# EAGLE board openadc_ztex (EAGLE 6.4), part 1 of 2
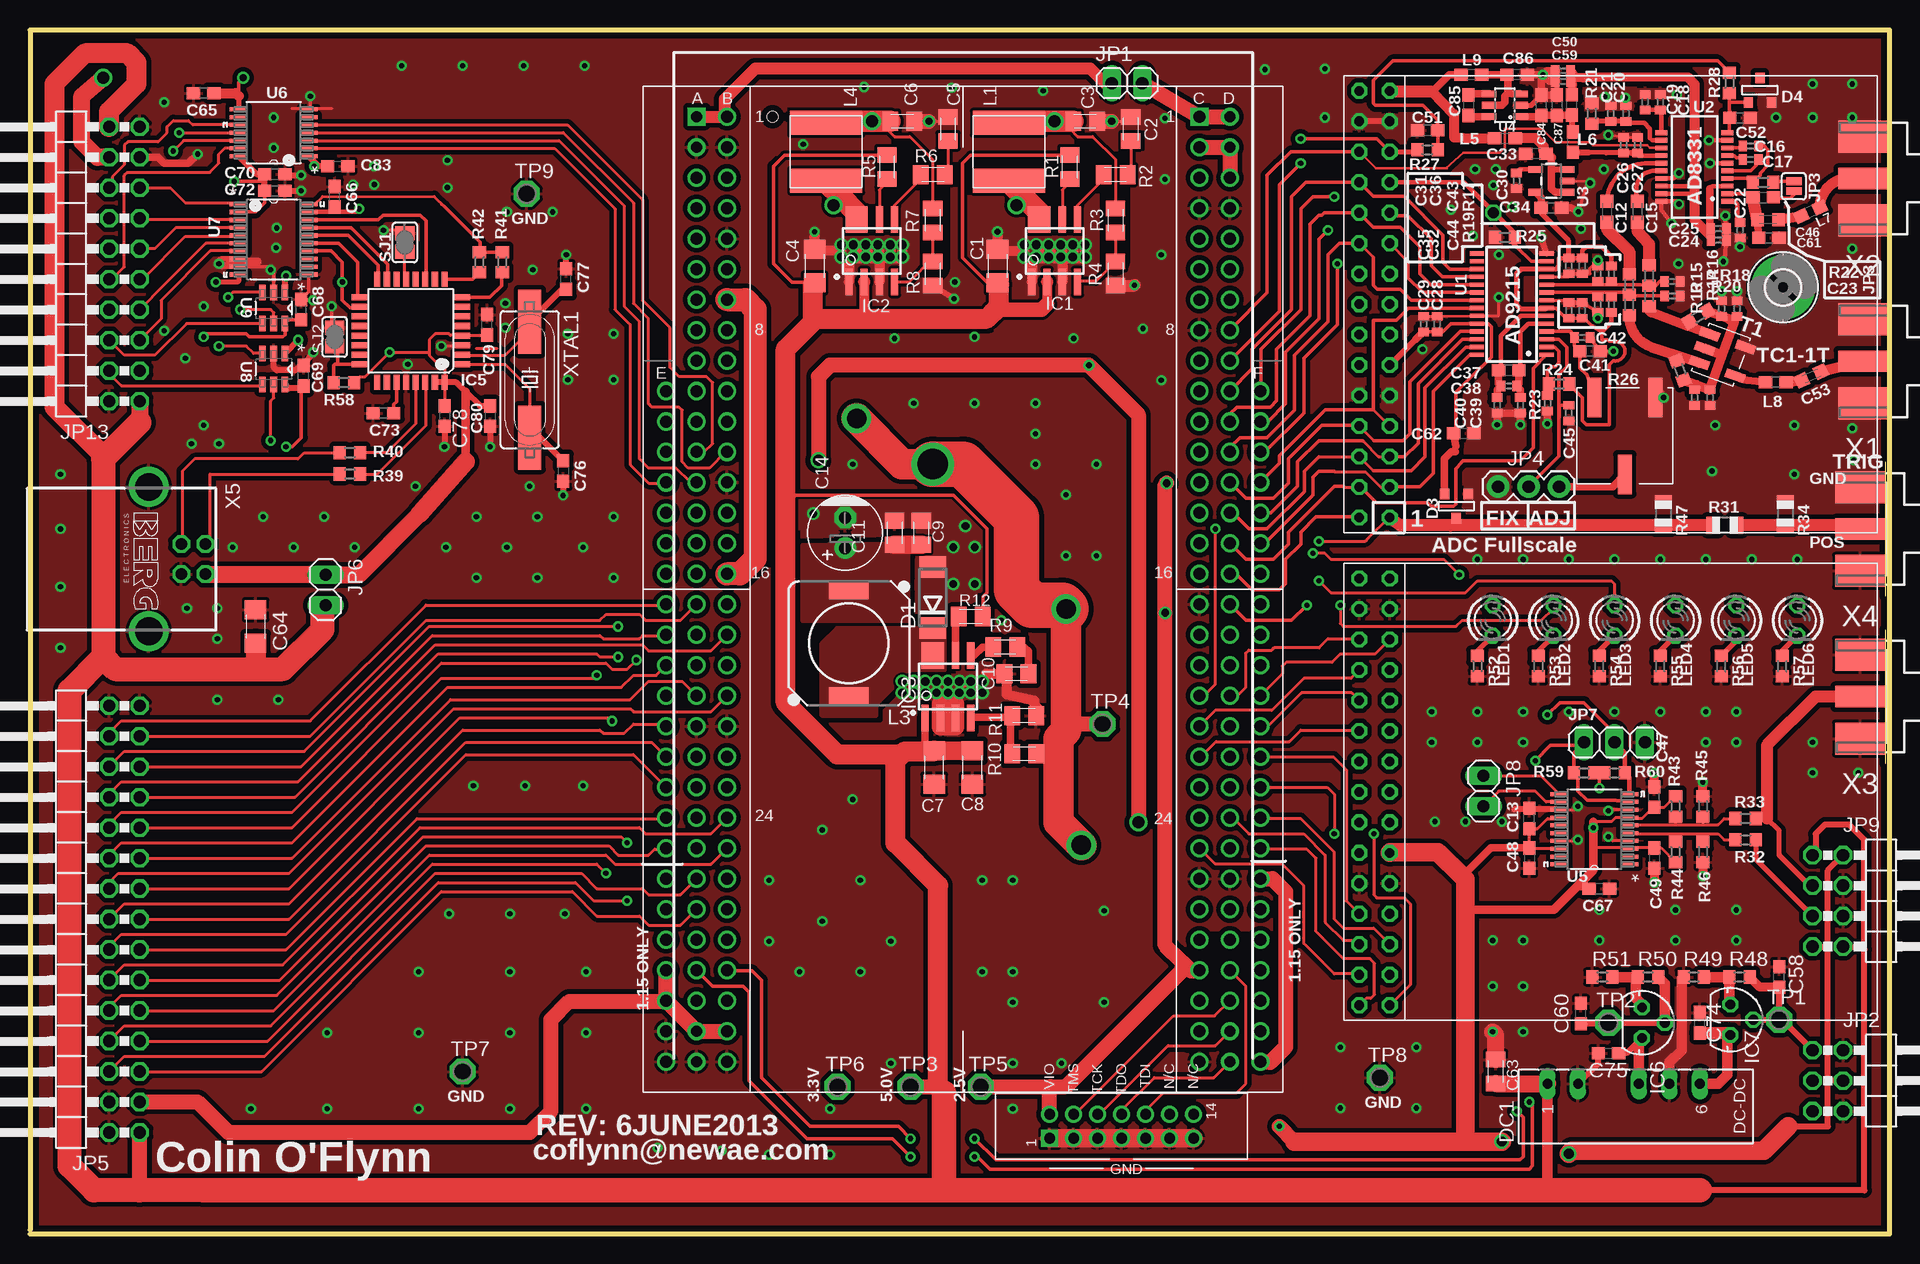
[diagram p8: board, top side]
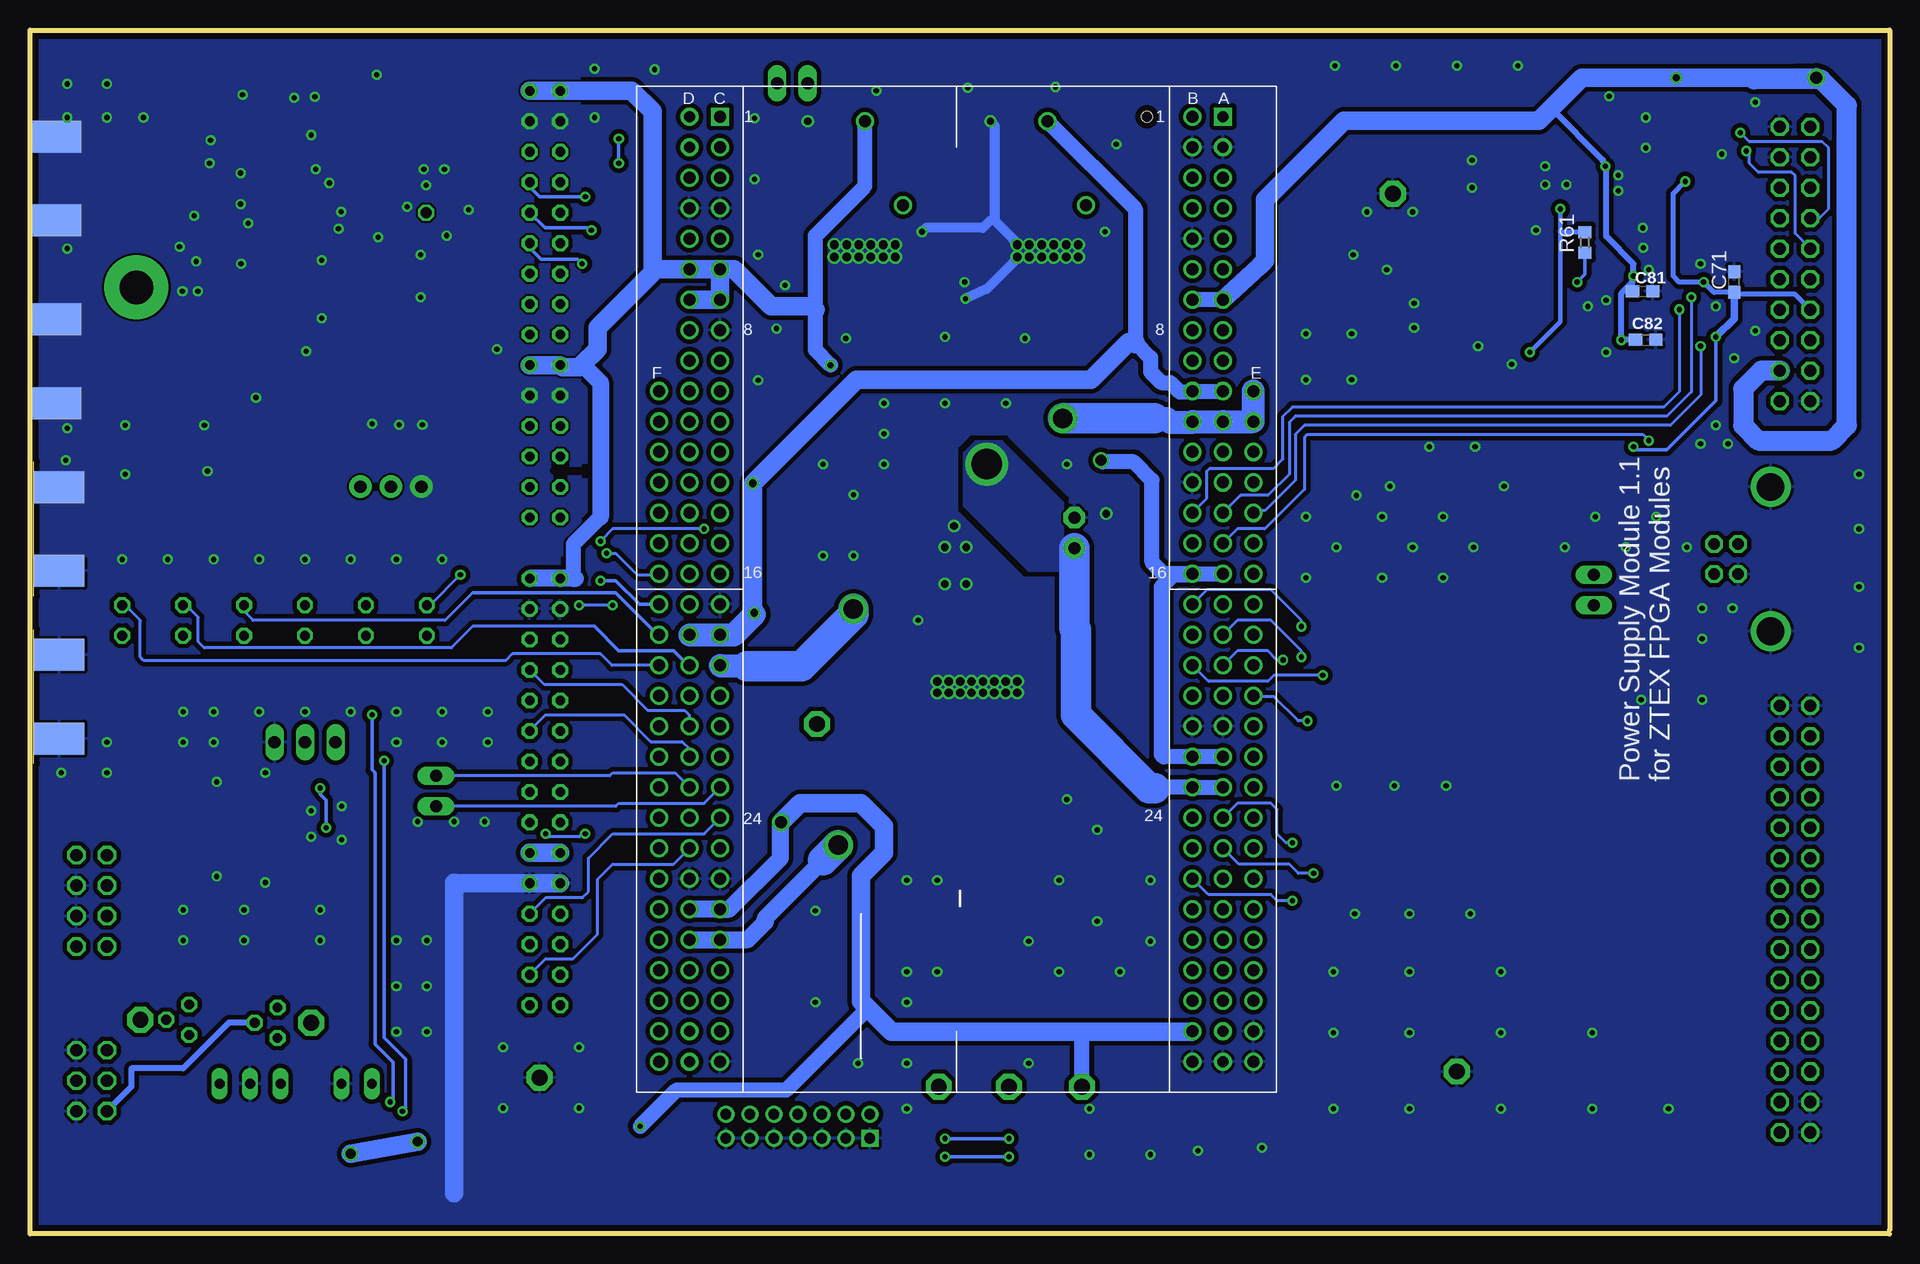
[diagram p9: board, bottom side, seen from below]

Size 155 x 100.32 mm. Coordinates in mm from the lower left corner, seen from the top.
Outline: 0,0 155,0 155,100.32 0,100.32 0,0.32
Copper layers (1*16): Top 0.035mm / dielectric 1.5mm / Bottom 0.035mm
Design rules "default *": minimum track width 7mil, minimum drill 17mil, track to track 7mil, track to pad 7mil, pad to pad 7mil, via to via 7mil, smd to smd 2mil, copper to edge 20mil, drill to drill 12mil, minimum pad ring 10mil, minimum via ring 8mil, stop-mask expansion 4mil, vias tented up to drill 170mil, thermal gap 10mil
tRestrict: 12 lines
bRestrict: 1 lines

## Footprints (pad centres in the part's own frame; a part is rotated, then mirrored left to right if it is on the bottom)
C1206 = smd 1.6 x 1.8: 1 -1.4,0; 2 1.4,0
C0805K = smd 1.3 x 1.6: 1 -1,0; 2 1,0
C0603K = smd 1.05 x 1.08: 1 -0.875,0; 2 0.875,0
C0603 = smd 1.1 x 1: 1 -0.85,0; 2 0.85,0
E2,5-6 = drill 1 pad 1.8: + -1.27,0 | drill 1 pad 1.8 octagon: - 1.27,0
C0402 = smd 0.7 x 0.9: 1 -0.65,0; 2 0.65,0
JTAG = drill 0.9 square: 1 1,-6 | drill 0.9: 2 -1,-6; 3 1,-4; 4 -1,-4; 5 1,-2; 6 -1,-2; 7 1,0; 8 -1,0; 9 1,2; 10 -1,2; 11 1,4; 12 -1,4; 13 1,6; 14 -1,6
USB-FPGA1.15 = drill 0.925 pad 1.5 square: A1 2.54,1.905 | drill 0.925 pad 1.5: A2 5.08,1.905; A31 78.74,1.905; A32 81.28,1.905; D1 2.54,46.355; D2 5.08,46.355; D31 78.74,46.355; D32 81.28,46.355 | drill 1 pad 1.5: A3 7.62,1.905; A4 10.16,1.905; A5 12.7,1.905; A6 15.24,1.905; A7 17.78,1.905; A8 20.32,1.905; A9 22.86,1.905; A10 25.4,1.905; A11 27.94,1.905; A12 30.48,1.905; A13 33.02,1.905; A14 35.56,1.905; A15 38.1,1.905; A16 40.64,1.905; A17 43.18,1.905; A18 45.72,1.905; A19 48.26,1.905; A20 50.8,1.905; A21 53.34,1.905; A22 55.88,1.905; A23 58.42,1.905; A24 60.96,1.905; A25 63.5,1.905; A26 66.04,1.905; A27 68.58,1.905; A28 71.12,1.905; A29 73.66,1.905; A30 76.2,1.905; B1 2.54,4.445; B2 5.08,4.445; B3 7.62,4.445; B4 10.16,4.445; B5 12.7,4.445; B6 15.24,4.445; B7 17.78,4.445; B8 20.32,4.445; B9 22.86,4.445; B10 25.4,4.445; B11 27.94,4.445; B12 30.48,4.445; B13 33.02,4.445; B14 35.56,4.445; B15 38.1,4.445; B16 40.64,4.445; B17 43.18,4.445; B18 45.72,4.445; B19 48.26,4.445; B20 50.8,4.445; B21 53.34,4.445; B22 55.88,4.445; B23 58.42,4.445; B24 60.96,4.445; B25 63.5,4.445; B26 66.04,4.445; B27 68.58,4.445; B28 71.12,4.445; B29 73.66,4.445; B30 76.2,4.445; B31 78.74,4.445; B32 81.28,4.445; C2 5.08,43.815; C3 7.62,43.815; C4 10.16,43.815; C5 12.7,43.815; C6 15.24,43.815; C7 17.78,43.815; C8 20.32,43.815; C9 22.86,43.815; C10 25.4,43.815; C11 27.94,43.815; C12 30.48,43.815; C13 33.02,43.815; C14 35.56,43.815; C15 38.1,43.815; C16 40.64,43.815; C17 43.18,43.815; C18 45.72,43.815; C19 48.26,43.815; C20 50.8,43.815; C21 53.34,43.815; C22 55.88,43.815; C23 58.42,43.815; C24 60.96,43.815; C25 63.5,43.815; C26 66.04,43.815; C27 68.58,43.815; C28 71.12,43.815; C29 73.66,43.815; C30 76.2,43.815; C31 78.74,43.815; C32 81.28,43.815; D3 7.62,46.355; D4 10.16,46.355; D5 12.7,46.355; D6 15.24,46.355; D7 17.78,46.355; D8 20.32,46.355; D9 22.86,46.355; D10 25.4,46.355; D11 27.94,46.355; D12 30.48,46.355; D13 33.02,46.355; D14 35.56,46.355; D15 38.1,46.355; D16 40.64,46.355; D17 43.18,46.355; D18 45.72,46.355; D19 48.26,46.355; D20 50.8,46.355; D21 53.34,46.355; D22 55.88,46.355; D23 58.42,46.355; D24 60.96,46.355; D25 63.5,46.355; D26 66.04,46.355; D27 68.58,46.355; D28 71.12,46.355; D29 73.66,46.355; D30 76.2,46.355; E10 25.4,-0.635; E11 27.94,-0.635; E12 30.48,-0.635; E13 33.02,-0.635; E14 35.56,-0.635; E15 38.1,-0.635; E16 40.64,-0.635; E17 43.18,-0.635; E18 45.72,-0.635; E19 48.26,-0.635; E20 50.8,-0.635; E21 53.34,-0.635; E22 55.88,-0.635; E23 58.42,-0.635; E24 60.96,-0.635; E25 63.5,-0.635; E26 66.04,-0.635; E27 68.58,-0.635; E28 71.12,-0.635; E29 73.66,-0.635; E30 76.2,-0.635; E31 78.74,-0.635; E32 81.28,-0.635; F10 25.4,48.895; F11 27.94,48.895; F12 30.48,48.895; F13 33.02,48.895; F14 35.56,48.895; F15 38.1,48.895; F16 40.64,48.895; F17 43.18,48.895; F18 45.72,48.895; F19 48.26,48.895; F20 50.8,48.895; F21 53.34,48.895; F22 55.88,48.895; F23 58.42,48.895; F24 60.96,48.895; F25 63.5,48.895; F26 66.04,48.895; F27 68.58,48.895; F28 71.12,48.895; F29 73.66,48.895; F30 76.2,48.895; F31 78.74,48.895; F32 81.28,48.895 | drill 1 pad 1.5 square: C1 2.54,43.815 | hole 0.9: 2.54,8.255
DO214AA = smd 1.8 x 2.2: A 2.55,0; C -2.55,0
SOT-23 = smd 0.787 x 0.889: 1 0.025,-1.016; 2 -0.94,1.016; 3 0.991,1.016
NMA = drill 0.813 long: 1 0,6.35; 2 0,3.81; 4 0,-1.27; 5 0,-3.81; 6 0,-6.35
2,8-PAD = drill 2.8 pad 5.334: B2,8 0,0
AOZ1021 = smd 0.6 x 2.2: AGND 0.635,-2.6; COMP 1.905,2.6; EN 0.635,2.6; FB 1.905,-2.6; PGND -1.905,-2.6; VIN -0.635,-2.6 | smd 1.87 x 2.2: LX -1.27,2.6
AOZ1094.PAC = smd 0.6 x 2.2: AGND 0.635,-2.6; COMP 1.905,2.6; EN 0.635,2.6; FB 1.905,-2.6; PGND -0.635,-2.6; VIN -1.905,-2.6 | smd 1.87 x 2.2: LX -1.27,2.6
TQFP32-08 = smd 1.27 x 0.508: 1 -4.293,2.8; 2 -4.293,2; 3 -4.293,1.2; 4 -4.293,0.4; 5 -4.293,-0.4; 6 -4.293,-1.2; 7 -4.293,-2; 8 -4.293,-2.8; 17 4.293,-2.8; 18 4.293,-2; 19 4.293,-1.2; 20 4.293,-0.4; 21 4.293,0.4; 22 4.293,1.2; 23 4.293,2; 24 4.293,2.8 | smd 0.508 x 1.27: 9 -2.8,-4.293; 10 -2,-4.293; 11 -1.2,-4.293; 12 -0.4,-4.293; 13 0.4,-4.293; 14 1.2,-4.293; 15 2,-4.293; 16 2.8,-4.293; 25 2.8,4.293; 26 2,4.293; 27 1.2,4.293; 28 0.4,4.293; 29 -0.4,4.293; 30 -1.2,4.293; 31 -2,4.293; 32 -2.8,4.293
337L = drill 0.813 octagon: ADJ -1.27,0; IN 1.27,0; OUT 0,1.905
317L = drill 0.813 octagon: 1 -1.27,0; 2 0,1.905; 3 1.27,0
1X02 = drill 1.016 long: 1 -1.27,0; 2 1.27,0
2X03/90 = drill 1.016 octagon: 1 -2.54,-6.35; 2 -2.54,-3.81; 3 0,-6.35; 4 0,-3.81; 5 2.54,-6.35; 6 2.54,-3.81
SJ_2S = smd 0.635 x 1.27: 1 -0.412,0; 2 0.412,0
1X03 = drill 1.016 pad 1.88: 1 0,0; 2 2.54,0; 3 5.08,0
2X15/90 = drill 1.016 octagon: 1 -17.78,-6.35; 2 -17.78,-3.81; 3 -15.24,-6.35; 4 -15.24,-3.81; 5 -12.7,-6.35; 6 -12.7,-3.81; 7 -10.16,-6.35; 8 -10.16,-3.81; 9 -7.62,-6.35; 10 -7.62,-3.81; 11 -5.08,-6.35; 12 -5.08,-3.81; 13 -2.54,-6.35; 14 -2.54,-3.81; 15 0,-6.35; 16 0,-3.81; 17 2.54,-6.35; 18 2.54,-3.81; 19 5.08,-6.35; 20 5.08,-3.81; 21 7.62,-6.35; 22 7.62,-3.81; 23 10.16,-6.35; 24 10.16,-3.81; 25 12.7,-6.35; 26 12.7,-3.81; 27 15.24,-6.35; 28 15.24,-3.81; 29 17.78,-6.35; 30 17.78,-3.81
1X03' = drill 1.016 long: 1 -2.54,0; 2 0,0; 3 2.54,0
2X04/90 = drill 1.016 octagon: 1 -3.81,-6.35; 2 -3.81,-3.81; 3 -1.27,-6.35; 4 -1.27,-3.81; 5 1.27,-6.35; 6 1.27,-3.81; 7 3.81,-6.35; 8 3.81,-3.81
2X10/90 = drill 1.016 octagon: 1 -11.43,-6.35; 2 -11.43,-3.81; 3 -8.89,-6.35; 4 -8.89,-3.81; 5 -6.35,-6.35; 6 -6.35,-3.81; 7 -3.81,-6.35; 8 -3.81,-3.81; 9 -1.27,-6.35; 10 -1.27,-3.81; 11 1.27,-6.35; 12 1.27,-3.81; 13 3.81,-6.35; 14 3.81,-3.81; 15 6.35,-6.35; 16 6.35,-3.81; 17 8.89,-6.35; 18 8.89,-3.81; 19 11.43,-6.35; 20 11.43,-3.81
NR60 = smd 2 x 6: P$1 -2.4,0; P$2 2.4,0
0603 = smd 1.1 x 1: 1 -0.85,0; 2 0.85,0
DR1030 = smd 3.3 x 1.6: 1 0,4.45; 2 0,-4.45
LED-3MM = drill 0.813 octagon: A -1.27,0; K 1.27,0
R0805K = smd 1.3 x 1.6: 1 -1,0; 2 1,0
R0603 = smd 1 x 1.1: 1 -0.85,0; 2 0.85,0
R0402 = smd 0.7 x 0.9: 1 -0.65,0; 2 0.65,0
3361P = smd 1.19 x 3.3: 1 -2.54,0; 2 0,6.4; 3 2.54,0
R0805 = smd 1.1 x 1.4: 1 -1,0; 2 1,0
SJ = smd 1.168 x 1.6: 1 -0.762,0; 2 0.762,0
AT224-1A = smd 0.762 x 1.651: 1 -1.27,2.54; 2 0,2.54; 3 1.27,2.54; 4 1.27,-0.635; 6 -1.27,-0.635
P1-13 = drill 1.321 pad 2.159 octagon: TP 0,0
TSSOP28 = smd 0.35 x 1.2: 1 -4.225,-2.9; 2 -3.575,-2.9; 3 -2.925,-2.9; 4 -2.275,-2.9; 5 -1.625,-2.9; 6 -0.975,-2.9; 7 -0.325,-2.9; 8 0.325,-2.9; 9 0.975,-2.9; 10 1.625,-2.9; 11 2.275,-2.9; 12 2.925,-2.9; 13 3.575,-2.9; 14 4.225,-2.9; 15 4.225,2.9; 16 3.575,2.9; 17 2.925,2.9; 18 2.275,2.9; 19 1.625,2.9; 20 0.975,2.9; 21 0.325,2.9; 22 -0.325,2.9; 23 -0.975,2.9; 24 -1.625,2.9; 25 -2.275,2.9; 26 -2.925,2.9; 27 -3.575,2.9; 28 -4.225,2.9
QSOP20 = smd 0.4 x 1: 1 -2.858,-2.75; 2 -2.223,-2.75; 3 -1.588,-2.75; 4 -0.953,-2.75; 5 -0.318,-2.75; 6 0.318,-2.75; 7 0.953,-2.75; 8 1.588,-2.75; 9 2.223,-2.75; 10 2.858,-2.75; 11 2.858,2.75; 12 2.223,2.75; 13 1.588,2.75; 14 0.953,2.75; 15 0.318,2.75; 16 -0.318,2.75; 17 -0.953,2.75; 18 -1.588,2.75; 19 -2.223,2.75; 20 -2.858,2.75
SOT23-5 = smd 0.55 x 1.2: 1 -0.95,-1.3; 2 0,-1.3; 3 0.95,-1.3; 4 0.95,1.3; 5 -0.95,1.3
SOT23-6L = smd 0.55 x 1.2: 1 -0.95,-1.3; 2 0,-1.3; 3 0.95,-1.3; 4 0.95,1.3; 5 0,1.3; 6 -0.95,1.3
SOP65P640X120-20N = smd 1.473 x 0.356: 1 -2.921,2.921; 2 -2.921,2.286; 3 -2.921,1.626; 4 -2.921,0.965; 5 -2.921,0.33; 6 -2.921,-0.33; 7 -2.921,-0.965; 8 -2.921,-1.626; 9 -2.921,-2.286; 10 -2.921,-2.921; 11 2.921,-2.921; 12 2.921,-2.286; 13 2.921,-1.626; 14 2.921,-0.965; 15 2.921,-0.33; 16 2.921,0.33; 17 2.921,0.965; 18 2.921,1.626; 19 2.921,2.286; 20 2.921,2.921
SOP65P640X120-14N = smd 1.473 x 0.356: 1 -2.921,1.956; 2 -2.921,1.295; 3 -2.921,0.66; 4 -2.921,0; 5 -2.921,-0.66; 6 -2.921,-1.295; 7 -2.921,-1.956; 8 2.921,-1.956; 9 2.921,-1.295; 10 2.921,-0.66; 11 2.921,0; 12 2.921,0.66; 13 2.921,1.295; 14 2.921,1.956
SOT95P280X145-6N = smd 1.27 x 0.559: 1 -1.295,0.94; 2 -1.295,0; 3 -1.295,-0.94; 4 1.295,-0.94; 5 1.295,0; 6 1.295,0.94
OPENADCREV1 = drill 0.8 octagon: 1 0,17.78; 2 2.54,17.78; 3 0,15.24; 4 2.54,15.24; 5 0,12.7; 6 2.54,12.7; 7 0,10.16; 8 2.54,10.16; 9 0,7.62; 10 2.54,7.62; 11 0,5.08; 12 2.54,5.08; 13 0,2.54; 14 2.54,2.54; 15 0,0; 16 2.54,0; 17 0,-2.54; 18 2.54,-2.54; 19 0,-5.08; 20 2.54,-5.08; 21 0,-7.62; 22 2.54,-7.62; 23 0,-10.16; 24 2.54,-10.16; 25 0,-12.7; 26 2.54,-12.7; 27 0,-15.24; 28 2.54,-15.24; 29 0,-17.78; 30 2.54,-17.78
J502-ND-142-0711-821/826 = smd 4.191 x 1.778: 1 2.115,0 | smd 4.191 x 2.667: G@1 2.115,3.495; G@2 2.115,-3.495 | smd 4.191 x 2.667 bottom: G@3 2.115,3.495; G@4 2.115,-3.495
PN61729-S = drill 0.95 octagon: 1 1.25,4.71; 2 -1.25,4.71; 3 -1.25,2.71; 4 1.25,2.71 | drill 2.3 pad 2.9: S1 -6.02,0; S2 6.02,0
HC-49U = smd 5.334 x 1.93: 1 -4.826,0; 2 4.826,0

## Placement (x,y rotation side)
C1  10µ  [C1206]  80.64,80.64 270 top
C2  2n2  [C0805K]  91.76,92.07 270 top
C3  22µ  [C0805K]  87.95,92.71 180 top
C4  10µ  [C1206]  65.41,80.64 270 top
C5  2n2  [C0805K]  76.52,92.07 270 top
C6  22µ  [C0805K]  72.71,92.71 180 top
C7  10µ  [C1206]  75.37,38.86 90 top
C8  10µ  [C1206]  78.55,38.86 90 top
C9  22µ  [C0805K]  74.3,58.42 270 top
C10  2n2  [C0805K]  82.23,46.67 0 top
C11  22µ  [C0805K]  72.07,58.42 270 top
C12  100nF  [C0603K]  131.45,85.17 270 top
C13  100nF  [C0603]  124.97,34.61 90 top
C14  470u  [E2,5-6]  67.94,58.42 90 top
C15  100nF  [C0603K]  133.99,85.17 270 top
C16  100nF  [C0402]  143.42,90.65 180 top
C17  100nF  [C0402]  143.42,89.52 0 top
C18  1nF  [C0402]  135.9,94.3 90 top
C19  100nF  [C0402]  134.63,94.3 90 top
C20  1nF  [C0402]  133.03,93.36 90 top
C21  100nF  [C0402]  131.76,93.36 90 top
C22  100nF  [C0402]  142.54,83.63 90 top
C23  18nF  [C0603]  144.47,86.36 0 top
C24  100nF  [C0402]  140.75,82.8 0 top
C25  1nF  [C0402]  140.75,83.77 0 top
C26  100nF  [C0402]  132.84,90.72 90 top
C27  1nF  [C0402]  134.01,90.72 90 top
C28  100nF  [C0402]  117.29,75.81 90 top
C29  10nF  [C0402]  116.16,75.81 90 top
C30  10nF, COG  [C0402]  123.91,87.75 90 top
C31  10nF  [C0402]  128.26,80.65 270 top
C32  100nF  [C0402]  129.38,76.94 90 top
C33  1u  [C0603]  125.52,90.01 180 top
C34  1u  [C0603]  126.81,85.49 0 top
C35  10nF  [C0402]  128.27,76.94 90 top
C36  100nF  [C0402]  129.39,80.65 270 top
C37  10u  [C0603]  123.26,71.94 180 top
C38  100nF  [C0402]  123.26,70.65 180 top
C39  100nF  [C0402]  124.23,69.04 90 top
C40  100nF  [C0402]  122.29,69.04 90 top
C41  10u  [C0603]  130.04,73.56 180 top
C42  100nF  [C0402]  129.39,74.68 180 top
C43  [C0402]  130.68,80.01 90 top
C44  [C0402]  130.68,77.43 270 top
C45  100nF  [C0402]  128.26,68.39 270 top
C46  100nF  [C0603K]  144.87,84.52 0 top
C47  100nF  [C0603]  135.38,36.39 90 top
C48  100nF  [C0603]  124.97,31.31 270 top
C49  100nF  [C0603]  135.38,31.31 270 top
C50  100nF  [C0402]  127.77,96.92 180 top
C51  1uF  [C0603]  116.49,91.94 180 top
C52  1uF  [C0603]  142.53,92.99 0 top
C53  [C0603K]  148.49,71.48 25 top
C54  1nF  [C0402]  140.04,69.68 270 top
C55  100nF  [C0402]  138.75,69.68 270 top
C56  1nF  [C0402]  142.29,77.1 270 top
C57  100nF  [C0402]  141,77.1 270 top
C58  100nF  [C0603]  145.8,21.4 90 top
C59  1u  [C0402]  127.77,96.03 0 top
C60  100nF  [C0603]  129.29,18.35 90 top
C61  22pF  [C0603]  144.95,82.99 0 top
C62  100nF  [C0603]  119.51,66.7 0 top
C63  22µ  [C0805K]  122.17,13.53 270 top
C64  10µ  [C1206]  18.8,50.61 270 top
C65  100nF  [C0603]  14.48,95.06 180 top
C66  100nF  [C0603]  25.4,86.42 90 top
C67  22nF  [C0603]  130.81,28.77 0 top
C68  22nF  [C0603]  22.6,77.02 90 top
C69  22nF  [C0603]  22.8,71.5 90 top
C70  100nF  [C0603]  20.4,88.32 0 top
C71  1uF  [C0603]  12.95,79.31 90 bottom
C72  100nF  [C0603]  20.4,86.92 0 top
C73  1uF  [C0603]  29.46,68.39 180 top
C74  100nF  [C0603]  139.19,17.59 90 top
C75  100nF  [C0603]  131.57,15.05 0 top
C76  22pF  [C0603]  44.45,63.56 270 top
C77  22pF  [C0603]  44.7,79.57 90 top
C78  100nF  [C0603]  34.54,68.14 270 top
C79  100nF  [C0603]  38.1,75.76 90 top
C80  100nF  [C0603]  38.35,68.14 270 top
C81  22nF  [C0603]  20.57,78.55 0 bottom
C82  22nF  [C0603]  20.32,74.49 0 bottom
C83  22nF  [C0603]  25.65,88.96 0 top
C84  1u  [C0603]  125.98,94.04 90 top
C85  1u  [C0603]  119.89,94.04 270 top
C86  1u  [C0603]  123.95,96.58 180 top
C87  1u  [C0603]  127.25,94.04 270 top
CON3  JTAG  [JTAG]  91,8.95 270 top
CON6  USB-FPGA1.15  [USB-FPGA1.15]  53.66,95.63 270 top
D1  [DO214AA]  75.25,53.02 90 top
D3  BAV99-7-F  [SOT-23]  118.87,60.64 0 top
D4  BAV99-7-F  [SOT-23]  144.22,95.3 180 top
DC1  [NMA]  132.84,12.51 90 top
H1  MOUNT-PAD-ROUND2.8  [2,8-PAD]  146.13,78.88 180 top
IC1  AOZ1021  [AOZ1021]  85.41,81.91 0 top
IC2  AOZ1021  [AOZ1021]  70.17,81.91 0 top
IC3  AOZ1094  [AOZ1094.PAC]  76.52,45.59 0 top
IC5  AT90USB162A  [TQFP32-08]  31.75,75.25 180 top
IC6  [337L]  134.37,17.59 270 top
IC7  [317L]  141.73,17.84 270 top
JP1  [1X02]  91.44,95.88 0 top
JP2  EXP-MINI  [2X03/90]  154.94,12.76 270 top
JP3  [SJ_2S]  147.03,87.3 90 top
JP4  JUMPER-3PTH  [1X03]  127.45,62.27 180 top
JP5  [2X15/90]  2.79,26.23 90 top
JP6  [1X02]  24.64,53.66 270 top
JP7  [1X03']  132.08,40.96 0 top
JP8  [1X02]  121.16,36.89 270 top
JP9  PLL_INPUT  [2X04/90]  154.94,27.75 270 top
JP13  TARGET  [2X10/90]  2.79,80.82 90 top
L1  4.7µ  [NR60]  81.6,90.17 90 top
L2  120nH  [0603]  128.53,94.08 90 top
L3  2.2uF  [DR1030]  68.26,49.21 180 top
L4  4.7µ  [NR60]  66.36,90.17 90 top
L5  120nH  [0603]  122.94,91.3 0 top
L6  120nH  [0603]  128.58,90.98 270 top
L7  120nH  [0603]  148.42,85.17 204.4 top
L8  [0603]  145.52,70.98 180 top
L9  120nH  [0603]  120.14,96.58 180 top
LED1  RED  [LED-3MM]  121.92,51.12 270 top
LED2  YELLOW  [LED-3MM]  127,51.12 270 top
LED3  GREEN  [LED-3MM]  132.08,51.12 270 top
LED4  BLUE  [LED-3MM]  137.16,51.12 270 top
LED5  BLUE  [LED-3MM]  142.24,51.12 270 top
LED6  GREEN  [LED-3MM]  147.32,51.12 270 top
R1  7K5  [R0805K]  86.68,88.9 90 top
R2  7K5  [R0805K]  90.49,88.27 180 top
R3  7K5  [R0805K]  90.49,84.45 90 top
R4  2K4  [R0805K]  90.49,80.01 90 top
R5  7K5  [R0805K]  71.44,88.9 90 top
R6  7K5  [R0805K]  75.25,88.27 180 top
R7  5K36  [R0805K]  75.25,84.45 90 top
R8  2K4  [R0805K]  75.25,80.01 90 top
R9  24k9,1%  [R0805K]  81.28,48.9 180 top
R10  1K2  [R0805K]  82.87,40.01 0 top
R11  2K4  [R0805K]  82.87,43.18 180 top
R12  7K5  [R0805K]  78.42,51.44 0 top
R13  33R, 0.5%  [R0603]  133.31,77.41 270 top
R14  33R, 0.5%  [R0603]  134.96,78.15 270 top
R15  33R  [R0603]  133.31,79.09 270 top
R16  33R  [R0603]  134.96,79.85 270 top
R17  1K  [R0402]  131.81,80.01 90 top
R18  1K  [R0402]  136.89,79.36 0 top
R19  1K  [R0402]  131.81,77.43 90 top
R20  1K  [R0402]  136.89,78.15 180 top
R21  10K  [R0603]  130.18,93.36 90 top
R22  274R  [R0603]  144.47,87.62 180 top
R23  1K  [R0402]  126.49,69.2 270 top
R24  2K  [R0603]  127.45,70.81 0 top
R25  [R0603]  122.94,83.04 0 top
R26  20k  [3361P]  132.94,69.68 180 top
R27  2k2  [R0603]  116.49,90.33 0 top
R28  2k2  [R0603]  141.65,95.91 270 top
R29  36R, 0.5%  [R0603]  137.54,71.94 110 top
R30  36R, 0.5%  [R0603]  139.07,76.46 30 top
R31  50R  [R0805]  141.27,59.04 180 top
R32  100R  [R0603]  143,32.83 180 top
R33  100R  [R0603]  143,34.61 180 top
R34  [R0805]  146.3,60.01 270 top
R39  27R  [R0603]  26.67,63.31 0 top
R40  27R  [R0603]  26.67,65.09 0 top
R41  470R  [R0603]  39.37,80.96 90 top
R42  470  [R0603]  37.47,80.96 90 top
R43  1k,1%  [R0603]  137.16,35.62 90 top
R44  1k,1%  [R0603]  137.16,31.81 270 top
R45  1k,1%  [R0603]  139.45,35.62 270 top
R46  1k,1%  [R0603]  139.45,31.81 90 top
R47  [R0805]  136.14,60.01 270 top
R48  200R,1%  [R0603]  142.49,21.4 0 top
R49  1k,1%  [R0603]  138.68,21.4 0 top
R50  200R,1%  [R0603]  134.87,21.4 0 top
R51  1k,1%  [R0603]  131.06,21.4 0 top
R52  220R  [R0603]  120.65,47.31 270 top
R53  220R  [R0603]  125.73,47.31 270 top
R54  220R  [R0603]  130.81,47.31 270 top
R55  220R  [R0603]  135.89,47.31 270 top
R56  220R  [R0603]  140.97,47.31 270 top
R57  220R  [R0603]  146.05,47.31 270 top
R58  1K  [R0603]  26.16,70.93 180 top
R59  4k7  [R0603]  129.54,38.42 180 top
R60  4k7  [R0603]  132.08,38.42 0 top
R61  470R  [R0603]  25.4,82.61 90 bottom
SJ1  [SJ]  31.24,82.61 90 top
SJ2  [SJ]  25.4,74.74 90 top
T1  TC1-1T  [AT224-1A]  141.97,72.91 70 top
TP1  TPSQPAD1-13  [P1-13]  145.8,17.84 0 top
TP2  TPSQPAD1-13  [P1-13]  131.57,17.59 0 top
TP3  PTR1PAD1-13  [P1-13]  73.41,12.26 0 top
TP4  PTR1PAD1-13  [P1-13]  89.41,42.48 0 top
TP5  PTR1PAD1-13  [P1-13]  79.25,12.26 0 top
TP6  PTR1PAD1-13  [P1-13]  67.31,12.26 0 top
TP7  PTR1PAD1-13  [P1-13]  36.07,13.53 0 top
TP8  PTR1PAD1-13  [P1-13]  112.52,13.02 0 top
TP9  PTR1PAD1-13  [P1-13]  41.4,86.68 0 top
U1  AD9215BRUZ  [TSSOP28]  123.51,77.47 90 top
U2  AD8331  [QSOP20]  138.75,88.9 90 top
U3  LP3985IM5-3.0  [SOT23-5]  126.81,87.75 90 top
U4  LTC3200ES6  [SOT23-6L]  122.94,94.04 90 top
U5  CDCE906PW  [SOP65P640X120-20N]  130.4,33.71 180 top
U6  TXB0104PWR  [SOP65P640X120-14N]  20.32,91.76 180 top
U7  TXB0108PWR  [SOP65P640X120-20N]  20.32,82.87 0 top
U8  SN74LVC1T45DBVT  [SOT95P280X145-6N]  20.32,72.07 270 top
U9  SN74LVC1T45DBVT  [SOT95P280X145-6N]  20.32,77.15 270 top
U$3  OPENADC  [OPENADCREV1]  113.35,77.47 180 top
U$5  OPENADC  [OPENADCREV1]  113.35,36.83 180 top
X1  SMA-142-0711-821/826  [J502-ND-142-0711-821/826]  154.94,72.71 180 top
X2  SMA-142-0711-821/826  [J502-ND-142-0711-821/826]  154.94,87.95 180 top
X3  SMA-142-0711-821/826  [J502-ND-142-0711-821/826]  154.69,44.77 180 top
X4  SMA-142-0711-821/826  [J502-ND-142-0711-821/826]  154.69,58.74 180 top
X5  PN61729-S  [PN61729-S]  9.91,56.23 270 top
XTAL1  16MHz  [HC-49U]  41.66,71.18 270 top